# EAGLE design Mainboard (EAGLE 7.7.0)
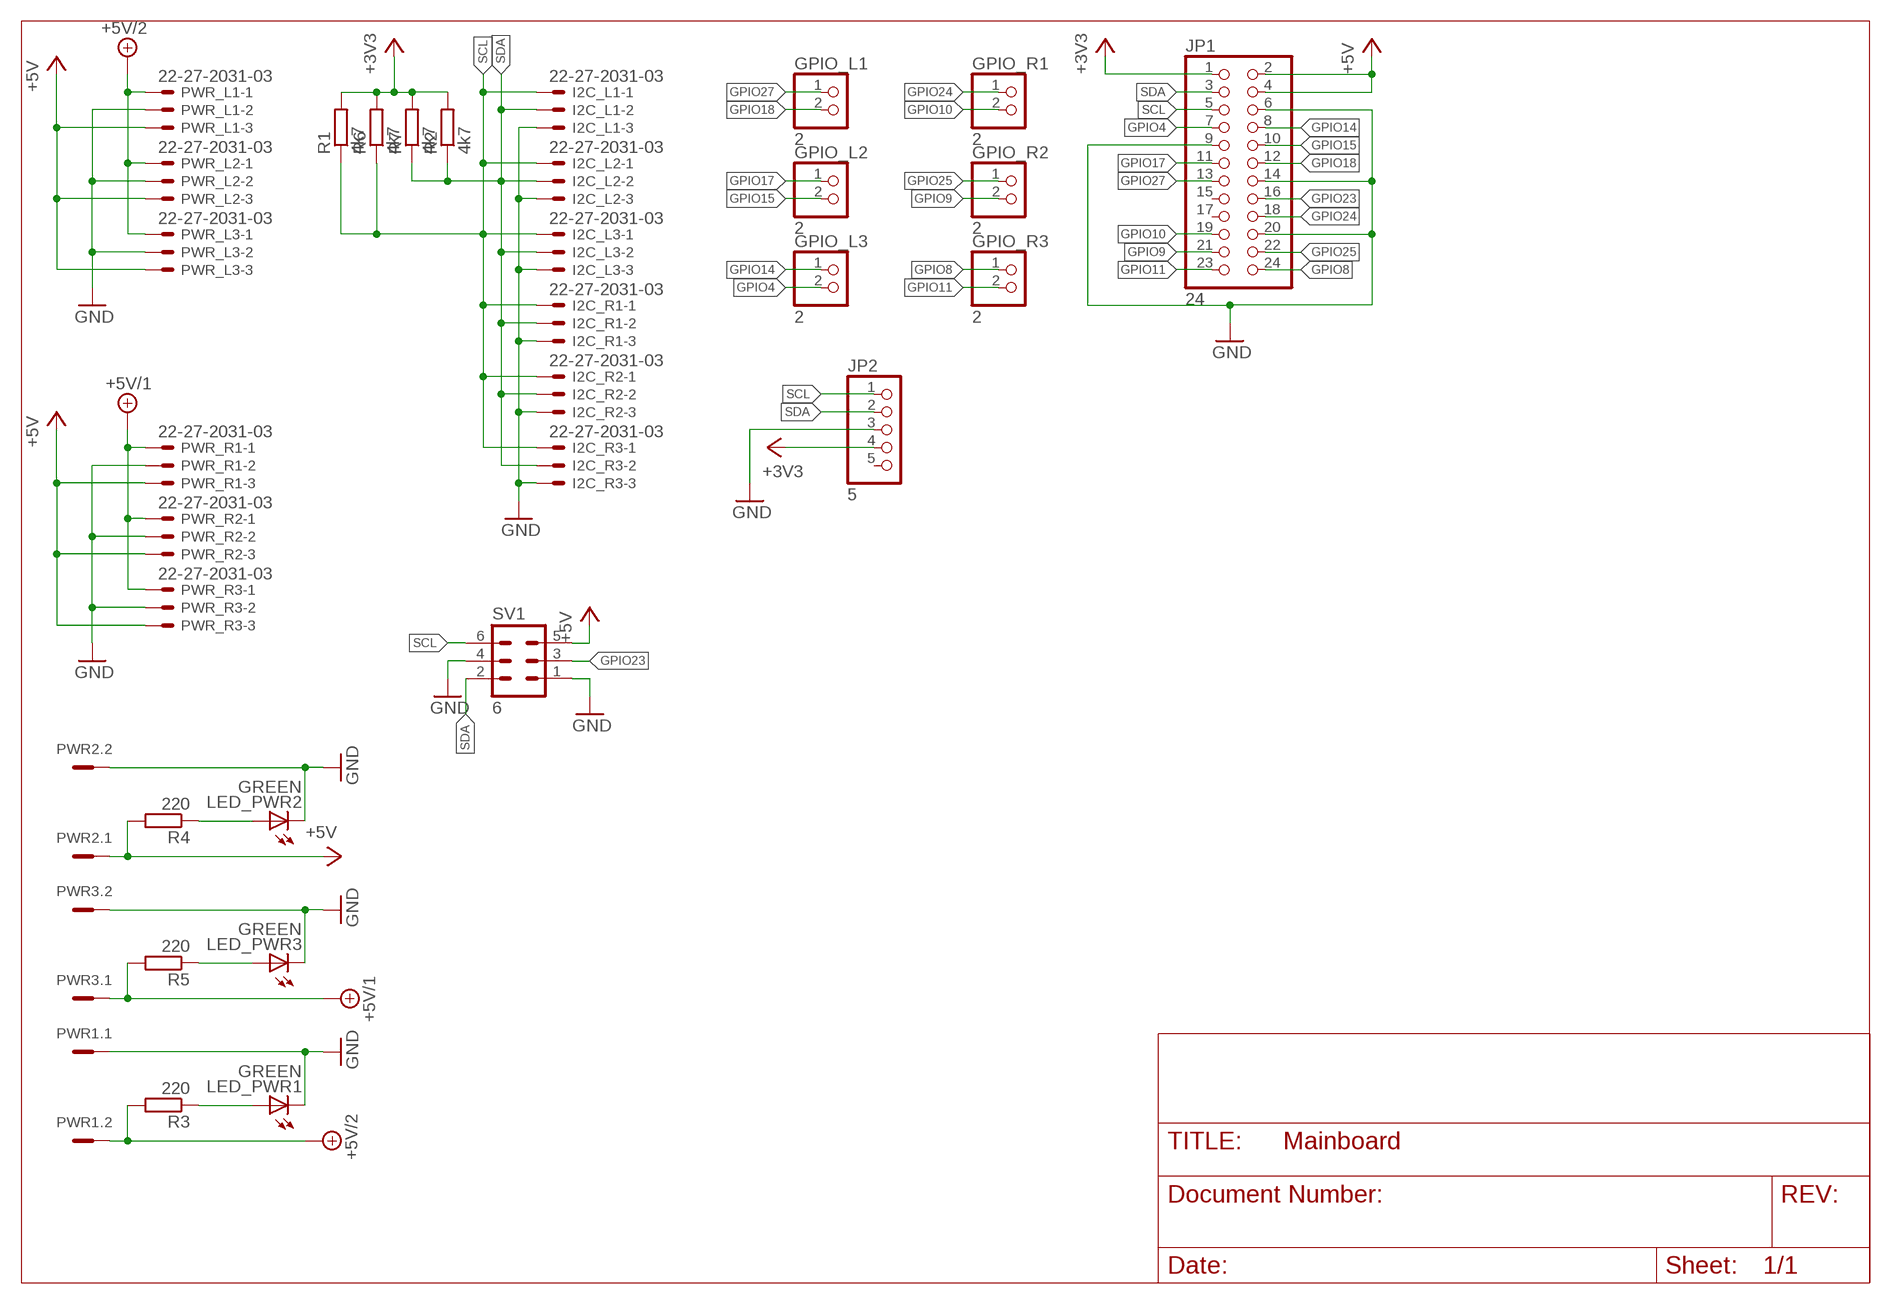
[diagram p0: schematic, sheet 1]

## Parts
GPIO_L1  2  PINHD-1X2  [1X02]
GPIO_L2  2  PINHD-1X2  [1X02]
GPIO_L3  2  PINHD-1X2  [1X02]
GPIO_R1  2  PINHD-1X2  [1X02]
GPIO_R2  2  PINHD-1X2  [1X02]
GPIO_R3  2  PINHD-1X2  [1X02]
I2C_L1  22-27-2031-03  [6410-03]
I2C_L2  22-27-2031-03  [6410-03]
I2C_L3  22-27-2031-03  [6410-03]
I2C_R1  22-27-2031-03  [6410-03]
I2C_R2  22-27-2031-03  [6410-03]
I2C_R3  22-27-2031-03  [6410-03]
JP1  24  PINHD-2X12  [2X12]
JP2  5  PINHD-1X5  [1X05]
LED_PWR1  GREEN  LEDCHIP-LED0805  [CHIP-LED0805]
LED_PWR2  GREEN  LEDCHIP-LED0805  [CHIP-LED0805]
LED_PWR3  GREEN  LEDCHIP-LED0805  [CHIP-LED0805]
PWR1  MCV2  [MCV2]
PWR2  MCV2  [MCV2]
PWR3  MCV2  [MCV2]
PWR_L1  22-27-2031-03  [6410-03]
PWR_L2  22-27-2031-03  [6410-03]
PWR_L3  22-27-2031-03  [6410-03]
PWR_R1  22-27-2031-03  [6410-03]
PWR_R2  22-27-2031-03  [6410-03]
PWR_R3  22-27-2031-03  [6410-03]
R1  4k7  R-EU_R0805  [R0805]
R2  4k7  R-EU_R0805  [R0805]
R3  220  R-EU_R0805  [R0805]
R4  220  R-EU_R0805  [R0805]
R5  220  R-EU_R0805  [R0805]
R6  4k7  R-EU_R0805  [R0805]
R7  4k7  R-EU_R0805  [R0805]
SV1  6  ML6  [ML6]

## Nets
+3V3: JP1.1 JP2.4 R1.2 R2.2 R6.2 R7.2
+5V: JP1.2 JP1.4 PWR2.1 PWR_L1.3 PWR_L2.3 PWR_L3.3 PWR_R1.3 PWR_R2.3 PWR_R3.3 R4.2 SV1.5
+5V/1: PWR3.1 PWR_R1.1 PWR_R2.1 PWR_R3.1 R5.2
+5V/2: PWR1.2 PWR_L1.1 PWR_L2.1 PWR_L3.1 R3.2
GND: I2C_L1.3 I2C_L2.3 I2C_L3.3 I2C_R1.3 I2C_R2.3 I2C_R3.3 JP1.6 JP1.9 JP1.14 JP1.20 JP2.3 LED_PWR1.C LED_PWR2.C LED_PWR3.C PWR1.1 PWR2.2 PWR3.2 PWR_L1.2 PWR_L2.2 PWR_L3.2 PWR_R1.2 PWR_R2.2 PWR_R3.2 SV1.1 SV1.4
GPIO4: GPIO_L3.2 JP1.7
GPIO8: GPIO_R3.1 JP1.24
GPIO9: GPIO_R2.2 JP1.21
GPIO10: GPIO_R1.2 JP1.19
GPIO11: GPIO_R3.2 JP1.23
GPIO14: GPIO_L3.1 JP1.8
GPIO15: GPIO_L2.2 JP1.10
GPIO17: GPIO_L2.1 JP1.11
GPIO18: GPIO_L1.2 JP1.12
GPIO23: JP1.16 SV1.3
GPIO24: GPIO_R1.1 JP1.18
GPIO25: GPIO_R2.1 JP1.22
GPIO27: GPIO_L1.1 JP1.13
N$1: LED_PWR1.A R3.1
N$2: LED_PWR2.A R4.1
N$3: LED_PWR3.A R5.1
SCL: I2C_L1.1 I2C_L2.1 I2C_L3.1 I2C_R1.1 I2C_R2.1 I2C_R3.1 JP1.5 JP2.1 R1.1 R6.1 SV1.6
SDA: I2C_L1.2 I2C_L2.2 I2C_L3.2 I2C_R1.2 I2C_R2.2 I2C_R3.2 JP1.3 JP2.2 R2.1 R7.1 SV1.2
Unconnected: JP1.15 JP1.17 JP2.5

## Library data of the parts
GPIO_L1-GPIO_L3 GPIO_R1-GPIO_R3 = pinhead:PINHD-1X2: PIN HEADER
I2C_L1-I2C_L3 I2C_R1-I2C_R3 PWR_L1-PWR_L3 PWR_R1-PWR_R3 = con-molex:22-?-03: CONNECTOR wire to board 2.54 mm (.1 inch) pitch header; OC_FARNELL: unknown; OC_NEWARK: unknown
JP1 = pinhead:PINHD-2X12: PIN HEADER
JP2 = pinhead:PINHD-1X5: PIN HEADER
LED_PWR1-LED_PWR3 = led:LED: LED OSRAM: - CHIPLED LG R971, LG N971, LY N971, LG Q971, LY Q971, LO R971, LY R971 LH N974, LH R974 LS Q976, LO Q976, LY Q976 LO Q996 - Hyper CHIPLED LW Q18S LB Q993, LB Q99A, LB R99A - SideLED LS A670, LO A670, LY A670, LG A670, LP A670 LB A673, LV A673, LT A673, LW A673 LH A674 LY A675 LS A676, LA A676, LO A676, LY A676, LW A676 LS A679, LY A679, LG A679 - Hyper Micro SIDELED® LS Y876, LA Y876, LO Y876, LY Y876 LT Y87S - SmartLED LW L88C, LW L88S LB L89C, LB L89S, LG L890 LS L89K, LO L89K, LY L89K LS L896, LA L896, LO L896, LY L896 - TOPLED LS T670, LO T670, LY T670, LG T670, LP T670 LSG T670, LSP T670, LSY T670, LOP T670, LYG T670 LG T671, LOG T671, LSG T671 LB T673, LV T673, LT T673, LW T673 LH T674 LS T676, LA T676, LO T676, LY T676, LB T676, LH T676, LSB T676, LW T676 LB T67C, LV T67C, LT T67C, LS T67K, LO T67K, LY T67K, LW E67C LS E67B, LA E67B, LO E67B, LY E67B, LB E67C, LV E67C, LT E67C LW T67C LS T679, LY T679, LG T679 LS T770, LO T770, LY T770, LG T770, LP T770 LB T773, LV T773, LT T773, LW T773 LH T774 LS E675, LA E675, LY E675, LS T675 LS T776, LA T776, LO T776, LY T776, LB T776 LHGB T686 LT T68C, LB T68C - Hyper Mini TOPLED® LB M676 - Mini TOPLED Santana® LG M470 LS M47K, LO M47K, LY M47K Source: http://www.osram.convergy.de LUXEON: - LUMILED® LXK2-PW12-R00, LXK2-PW12-S00, LXK2-PW14-U00, LXK2-PW14-V00 LXK2-PM12-R00, LXK2-PM12-S00, LXK2-PM14-U00 LXK2-PE12-Q00, LXK2-PE12-R00, LXK2-PE12-S00, LXK2-PE14-T00, LXK2-PE14-U00 LXK2-PB12-K00, LXK2-PB12-L00, LXK2-PB12-M00, LXK2-PB14-N00, LXK2-PB14-P00, LXK2-PB14-Q00 LXK2-PR12-L00, LXK2-PR12-M00, LXK2-PR14-Q00, LXK2-PR14-R00 LXK2-PD12-Q00, LXK2-PD12-R00, LXK2-PD12-S00 LXK2-PH12-R00, LXK2-PH12-S00 LXK2-PL12-P00, LXK2-PL12-Q00, LXK2-PL12-R00 Source: www.luxeon.com KINGBRIGHT: KA-3528ASYC Source: www.kingbright.com
PWR1-PWR3 = con-phoenix_3.81_mcv:MCV2: Mini-Combicon 3.81mm vertikal 2polig (ohne Gegenstecker)
R1-R7 = rcl:R-EU_: RESISTOR, European symbol
SV1 = con-harting-ml:ML6: HARTING; OC_FARNELL: unknown; OC_NEWARK: unknown

## Board
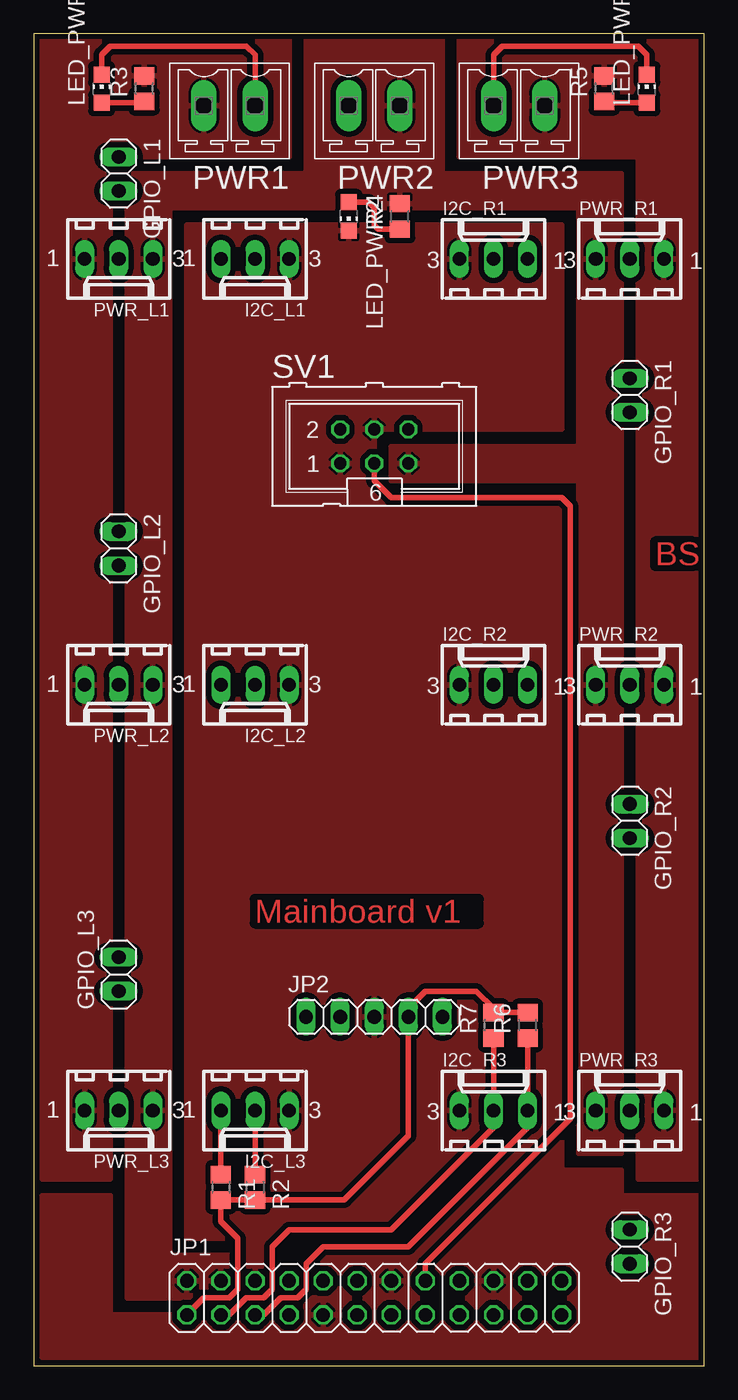
[diagram p1: board, top side]
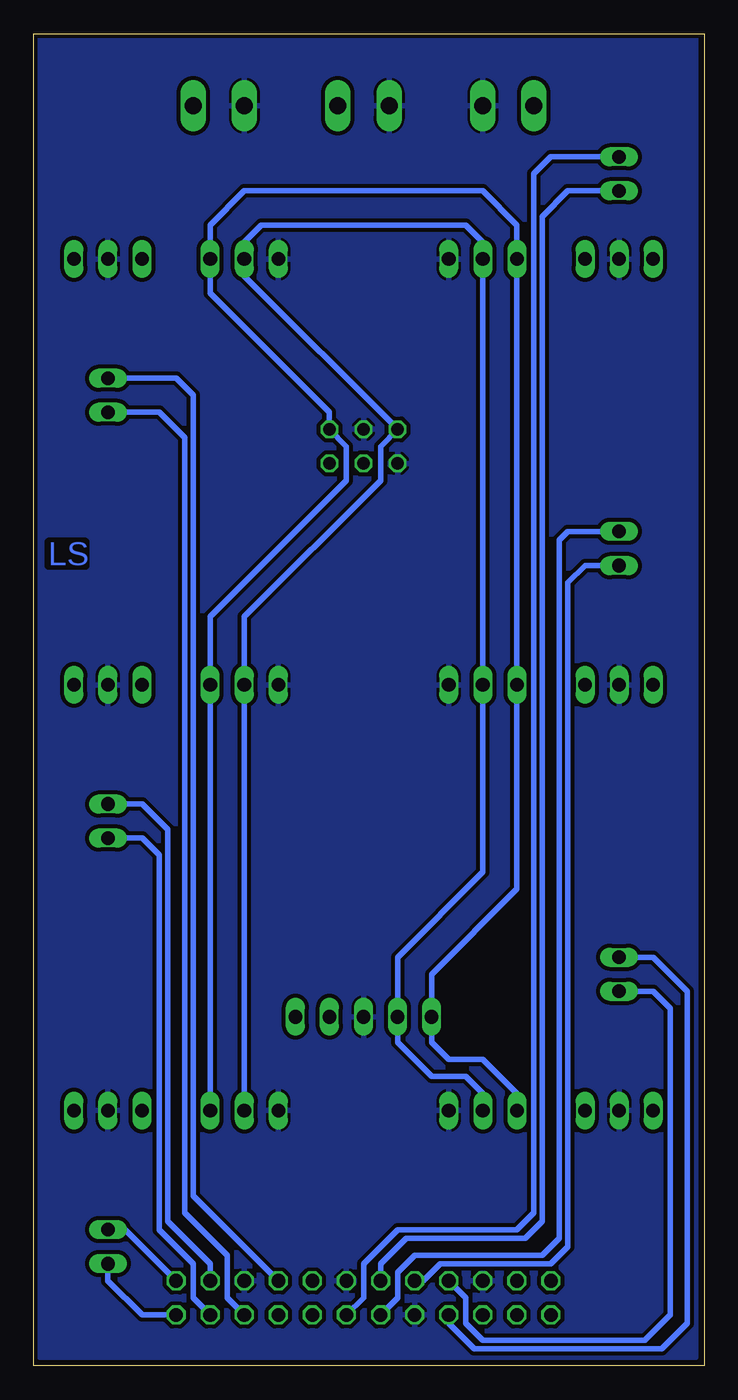
[diagram p2: board, bottom side, seen from below]

Size 50 x 99.36 mm. Coordinates in mm from the lower left corner, seen from the top.
Outline: 0,0 50,0 50,99.36 0,99.36 0,0
Copper layers (1*16): Top 0.035mm / dielectric 1.5mm / Bottom 0.035mm
Design rules "PCB-POOL Standard": minimum track width 0.15mm, minimum drill 0.3mm, track to track 0.15mm, track to pad 0.15mm, pad to pad 0.15mm, via to via 0.15mm, smd to smd 0.15mm, copper to edge 0.3mm, drill to drill 0.2mm, minimum pad ring 0.2mm, minimum via ring 0.15mm, stop-mask expansion 0.075mm, vias tented up to drill 0mil, thermal gap 0.2mm

### Footprints (pad centres in the part's own frame; a part is rotated, then mirrored left to right if it is on the bottom)
1X02 = drill 1.016 long: 1 -1.27,0; 2 1.27,0
6410-03 = drill 1.016 long: 1 2.54,0; 2 0,0; 3 -2.54,0
2X12 = drill 1.016 octagon: 1 -13.97,-1.27; 2 -13.97,1.27; 3 -11.43,-1.27; 4 -11.43,1.27; 5 -8.89,-1.27; 6 -8.89,1.27; 7 -6.35,-1.27; 8 -6.35,1.27; 9 -3.81,-1.27; 10 -3.81,1.27; 11 -1.27,-1.27; 12 -1.27,1.27; 13 1.27,-1.27; 14 1.27,1.27; 15 3.81,-1.27; 16 3.81,1.27; 17 6.35,-1.27; 18 6.35,1.27; 19 8.89,-1.27; 20 8.89,1.27; 21 11.43,-1.27; 22 11.43,1.27; 23 13.97,-1.27; 24 13.97,1.27
1X05 = drill 1.016 long: 1 -5.08,0; 2 -2.54,0; 3 0,0; 4 2.54,0; 5 5.08,0
CHIP-LED0805 = smd 1.2 x 1.2: A 0,-1.05; C 0,1.05
MCV2 = drill 1.27 pad 1.905 long: 1 -1.905,0; 2 1.905,0
R0805 = smd 1.3 x 1.5: 1 -0.95,0; 2 0.95,0
ML6 = drill 0.914 octagon: 1 -2.54,-1.27; 2 -2.54,1.27; 3 0,-1.27; 4 0,1.27; 5 2.54,-1.27; 6 2.54,1.27

### Placement (x,y rotation side)
GPIO_L1  6.35,88.9 270 top
GPIO_L2  6.35,60.96 270 top
GPIO_L3  6.35,29.21 90 top
GPIO_R1  44.45,72.39 270 top
GPIO_R2  44.45,40.64 270 top
GPIO_R3  44.45,8.89 270 top
I2C_L1  16.51,82.55 180 top
I2C_L2  16.51,50.8 180 top
I2C_L3  16.51,19.05 180 top
I2C_R1  34.29,82.55 0 top
I2C_R2  34.29,50.8 0 top
I2C_R3  34.29,19.05 0 top
JP1  25.4,5.08 0 top
JP2  25.4,26.04 0 top
LED_PWR1  5.08,95.25 0 top
LED_PWR2  23.5,85.72 180 top
LED_PWR3  45.72,95.25 0 top
PWR1  14.61,93.98 180 top
PWR2  25.4,93.98 180 top
PWR3  36.2,93.98 180 top
PWR_L1  6.35,82.55 180 top
PWR_L2  6.35,50.8 180 top
PWR_L3  6.35,19.05 180 top
PWR_R1  44.45,82.55 0 top
PWR_R2  44.45,50.8 0 top
PWR_R3  44.45,19.05 0 top
R1  13.97,13.34 270 top
R2  16.51,13.34 270 top
R3  8.26,95.25 90 top
R4  27.3,85.72 90 top
R5  42.55,95.25 90 top
R6  36.83,25.4 90 top
R7  34.29,25.4 90 top
SV1  25.4,68.58 0 top

### Tracks (layer width: path | path; a pad name or v marks a point on that pad's centre or on a via)
+3V3
  Top 0.406: JP1.1 12.7,5.08 14.61,5.08 15.24,5.71 15.24,9.53 13.97,10.79 R1.2 R2.2 23.18,12.38 27.94,17.14 JP2.4 27.94,26.67 29.21,27.94 33.02,27.94 34.29,26.67 R7.2 R6.2
+5V
  pour Top (isolate 0.406): 6.99,88.9 6.99,5.08 14.61,5.08 14.61,8.26 10.16,8.26 10.16,86.36 40.64,86.36 40.64,68.58 26.67,68.58 26.67,66.04 40.64,66.04 40.64,15.88 43.81,15.88 43.81,88.9 30.48,88.9 30.48,99.06 20.32,99.06 20.32,88.9
+5V/1
  pour Top (isolate 0.406): 31.75,99.06 49.53,99.06 49.53,13.97 45.09,13.97 45.09,90.17 31.75,90.17
+5V/2
  pour Top (isolate 0.406): 0.64,99.06 19.05,99.06 19.05,90.17 5.71,90.17 5.71,13.97 0.64,13.97
GND
  Top 0.406: LED_PWR1.C 5.08,97.79 5.71,98.42 15.88,98.42 16.51,97.79 PWR1.1 | LED_PWR3.C 45.72,97.79 45.09,98.42 34.92,98.42 34.29,97.79 PWR3.2
  pour Bottom (isolate 0.305): 0.64,99.06 49.53,99.06 49.53,0.64 0.64,0.64
  pour Top (isolate 0.406): 11.43,85.09 39.37,85.09 39.37,69.85 25.4,69.85 25.4,64.77 39.37,64.77 39.37,14.61 43.81,14.61 43.81,12.7 49.53,12.7 49.53,0.64 0.64,0.64 0.64,12.7 5.71,12.7 5.71,3.81 15.88,3.81 15.88,9.53 11.43,9.53
GPIO4
  Bottom 0.406: GPIO_L3.2 3.81,30.48 1.27,27.94 1.27,3.17 3.17,1.27 17.14,1.27 19.05,3.17 JP1.7
GPIO8
  Bottom 0.406: JP1.24 43.18,10.16 GPIO_R3.1
GPIO9
  Bottom 0.406: JP1.21 38.1,5.08 38.1,7.62 40.64,10.16 40.64,38.1 41.91,39.37 GPIO_R2.2
GPIO10
  Bottom 0.406: JP1.19 35.56,5.08 35.56,8.26 38.73,11.43 38.73,69.22 40.64,71.12 GPIO_R1.2
GPIO11
  Bottom 0.406: JP1.23 41.91,3.81 44.45,6.35 GPIO_R3.2
GPIO14
  Bottom 0.406: GPIO_L3.1 3.81,27.94 2.54,26.67 2.54,3.81 4.45,1.91 16.51,1.91 17.78,3.17 17.78,5.08 JP1.8
GPIO15
  Bottom 0.406: JP1.10 20.95,6.35 19.68,7.62 11.43,7.62 10.16,8.89 10.16,58.42 8.89,59.69 GPIO_L2.2
GPIO17
  Bottom 0.406: JP1.11 22.86,5.08 22.86,6.99 21.59,8.26 12.06,8.26 10.79,9.53 10.79,61.59 10.16,62.23 GPIO_L2.1
GPIO18
  Bottom 0.406: JP1.12 24.13,7.62 22.23,9.53 13.34,9.53 12.06,10.79 12.06,85.72 10.16,87.63 GPIO_L1.2
GPIO23
  Top 0.406: JP1.16 29.21,7.62 40.01,18.41 40.01,64.14 39.37,64.77 26.67,64.77 25.4,66.04 SV1.3
GPIO24
  Bottom 0.406: JP1.18 38.1,12.7 38.1,72.39 39.37,73.66 GPIO_R1.1
GPIO25
  Bottom 0.406: JP1.22 36.83,7.62 40.01,10.79 40.01,40.01 41.91,41.91 GPIO_R2.1
GPIO27
  Bottom 0.406: JP1.13 25.4,5.08 25.4,7.62 22.86,10.16 13.97,10.16 12.7,11.43 12.7,88.9 11.43,90.17 GPIO_L1.1
N$1
  Top 0.406: R3.1 8.15,94.2 LED_PWR1.A
N$2
  Top 0.406: R4.1 25.71,84.78 25.4,85.09 25.4,86.36 24.98,86.78 LED_PWR2.A
N$3
  Top 0.406: LED_PWR3.A 42.65,94.2 R5.1
SCL
  Top 0.406: JP1.5 17.14,3.81 18.41,5.08 19.68,5.08 20.32,5.71 20.32,7.62 21.59,8.89 27.94,8.89 36.83,17.78 I2C_R3.1 R6.1 | I2C_L3.1 R1.1
  Bottom 0.406: I2C_R3.1 I2C_R2.1 36.83,55.88 26.67,66.04 26.67,68.58 SV1.6 27.94,71.12 36.83,80.01 I2C_R1.1 36.83,85.09 34.29,87.63 16.51,87.63 13.97,85.09 I2C_L1.1 I2C_L2.1 13.97,35.56 20.32,29.21 JP2.1 20.32,24.13 19.05,22.86 16.51,22.86 13.97,20.32 I2C_L3.1
SDA
  Top 0.406: JP1.3 14.61,3.81 15.88,5.08 17.14,5.08 17.78,5.71 17.78,8.89 19.05,10.16 26.67,10.16 34.29,17.78 I2C_R3.2 R7.1 | R2.1 I2C_L3.2
  Bottom 0.406: I2C_R3.2 I2C_R2.2 34.29,55.88 24.13,66.04 24.13,68.58 SV1.2 34.29,81.28 I2C_R1.2 34.29,83.82 33.02,85.09 17.78,85.09 16.51,83.82 I2C_L1.2 I2C_L2.2 16.51,36.83 22.86,30.48 JP2.2 22.86,24.13 20.32,21.59 17.78,21.59 16.51,20.32 I2C_L3.2

### Text on the board
Top: BS | Mainboard v1
Bottom: LS